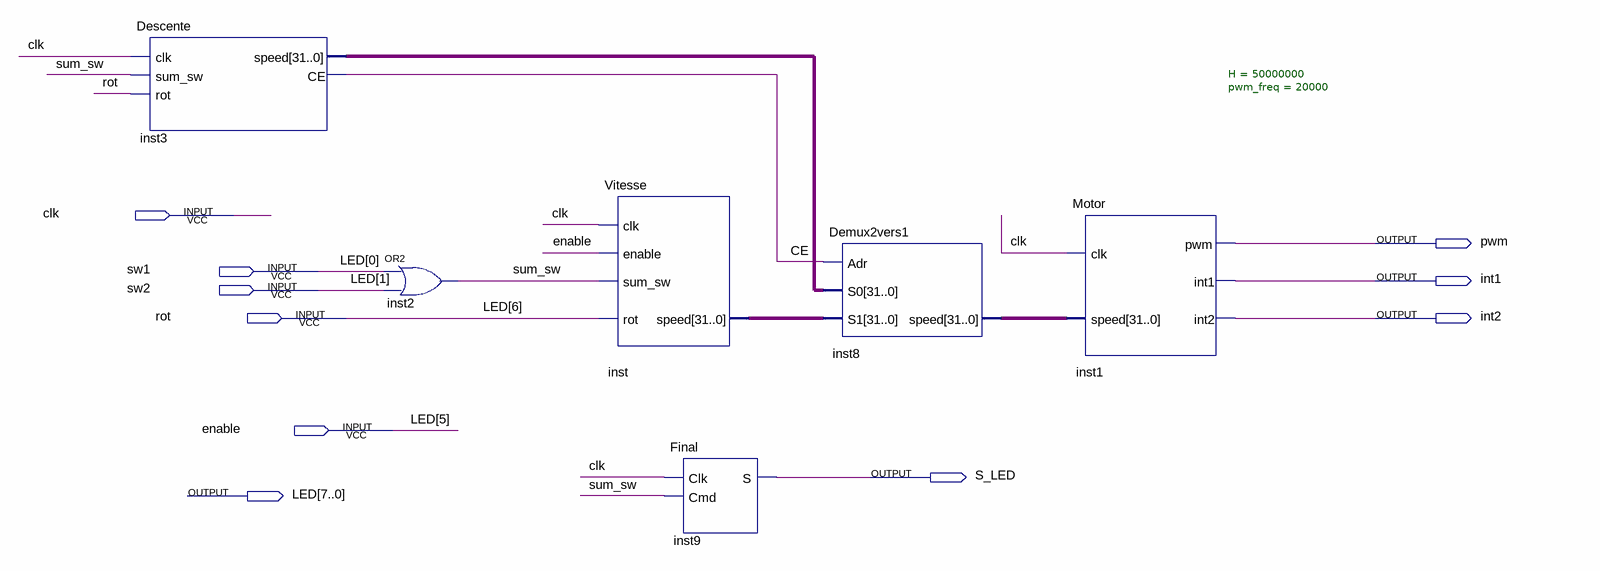
[diagram p0: schematic sheet]
// Quartus schematic DC.bdf as structural Verilog: 6 symbols, 10 pins
module DC (
  input  clk,
  input  sw1,
  input  sw2,
  input  rot,
  input  enable,
  output pwm,
  output int1,
  output int2,
  output S_LED,
  output [7:0] LED
);

  wire CE, sum_sw;
  wire [31:0] inst3_speed, inst8_speed, inst_speed;

  Descente inst3 (.clk(clk), .sum_sw(sum_sw), .rot(rot), .speed(inst3_speed), .CE(CE));
  or inst2 (sum_sw, sw1, sw2);
  Vitesse inst (.clk(clk), .sum_sw(sum_sw), .rot(rot), .enable(enable), .speed(inst_speed));
  Final inst9 (.Clk(clk), .Cmd(sum_sw), .S(S_LED));
  Demux2vers1 inst8 (.Adr(CE), .S0(inst3_speed), .S1(inst_speed), .speed(inst8_speed));
  Motor #(.H(50000000), .pwm_freq(20000)) inst1 (.clk(clk), .speed(inst8_speed), .pwm(pwm), .int1(int1), .int2(int2));

  assign {LED[6:5], LED[1:0]} = {rot, enable, sw2, sw1};
endmodule
